# EAGLE design main (EAGLE 6.3)
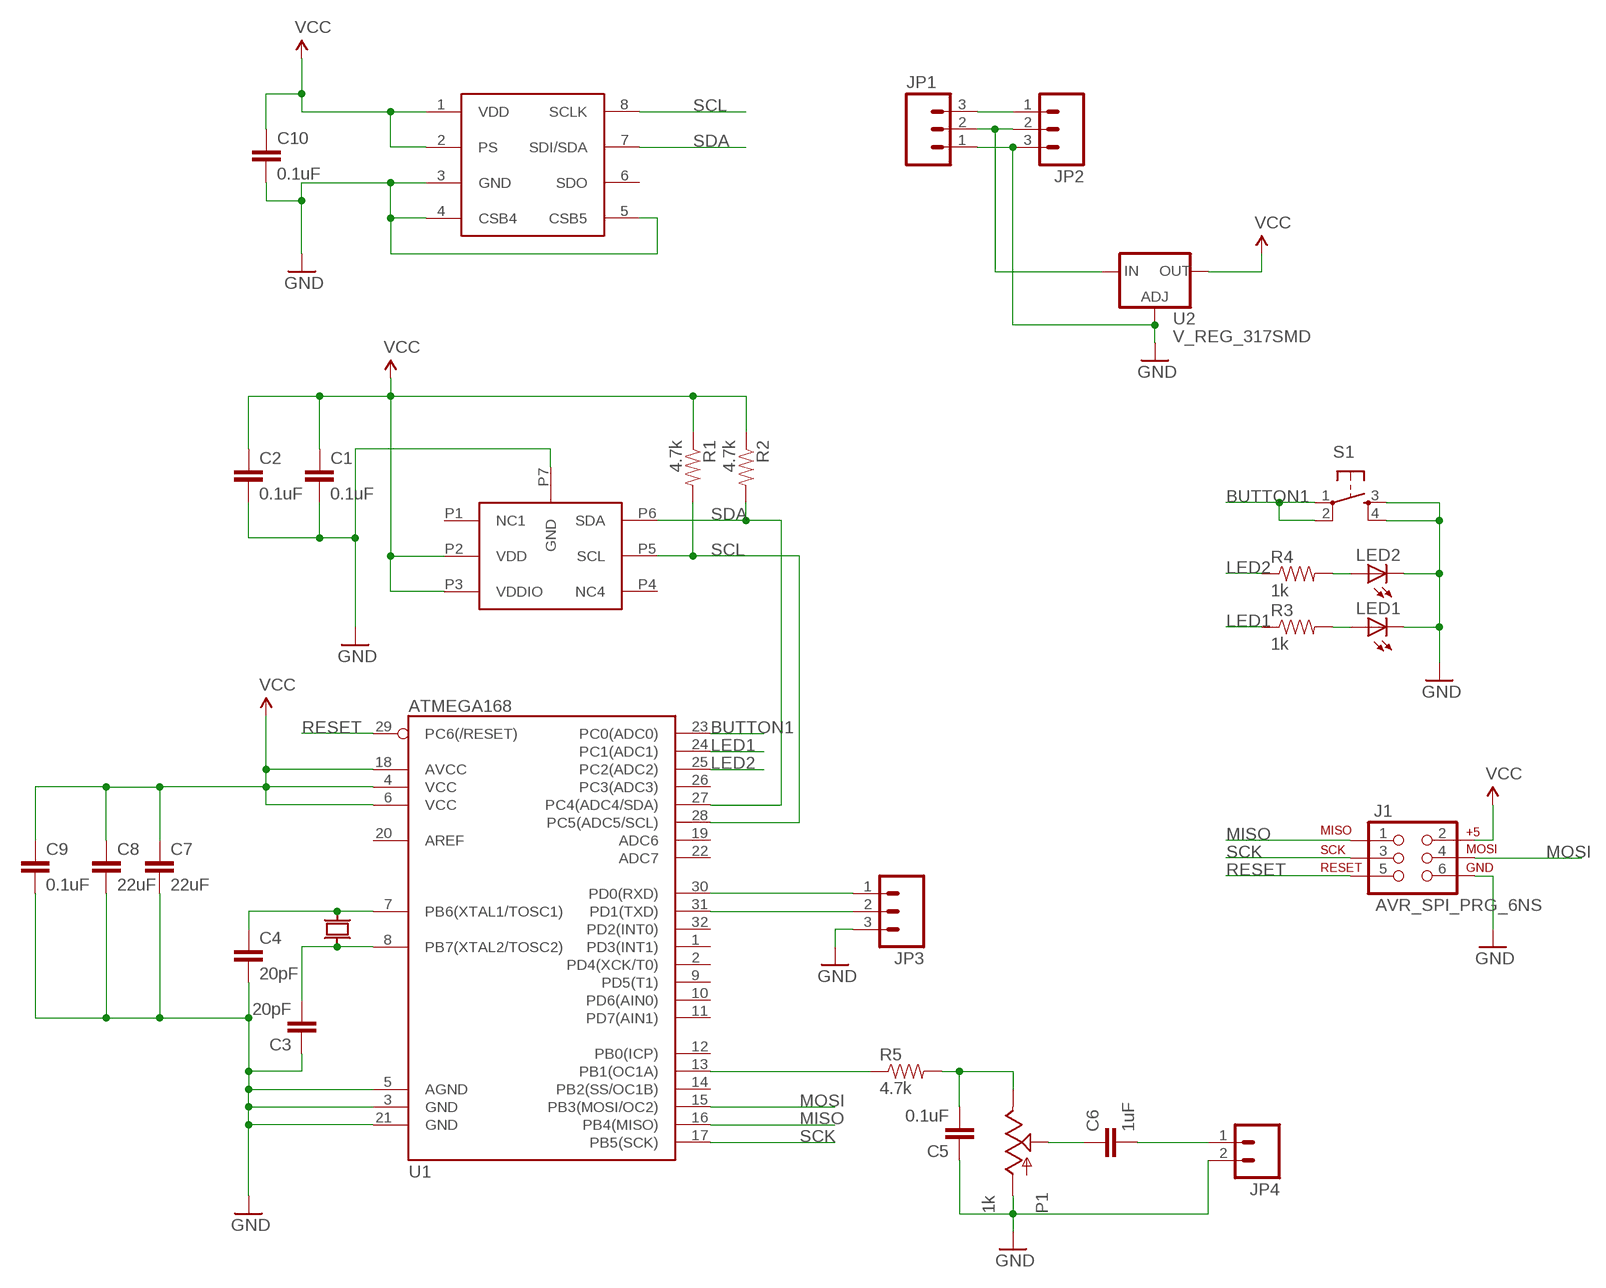
[diagram p0: schematic, sheet 1]

## Parts
C1  0.1uF  CAP0603-CAP  [0603-CAP]
C2  0.1uF  CAP0603-CAP  [0603-CAP]
C3  20pF  CAP0603-CAP  [0603-CAP]
C4  20pF  CAP0603-CAP  [0603-CAP]
C5  0.1uF  CAP0603-CAP  [0603-CAP]
C6  1uF  CAP0603-CAP  [0603-CAP]
C7  22uF  CAP0805  [0805]
C8  22uF  CAP0805  [0805]
C9  0.1uF  CAP0603-CAP  [0603-CAP]
C10  0.1uF  CAP0603-CAP  [0603-CAP]
J1  AVR_SPI_PRG_6NS  [2X3-NS]
JP1  M03PTH  [1X03]
JP2  M03PTH  [1X03]
JP3  M03PTH  [1X03]
JP4  M02PTH  [1X02]
LED1  LED0603  [LED-0603]
LED2  LED0603  [LED-0603]
P1  1k  POTTRIM  [TRIM_POT]
R1  4.7k  RESISTOR0603-RES  [0603-RES]
R2  4.7k  RESISTOR0603-RES  [0603-RES]
R3  1k  RESISTOR0603-RES  [0603-RES]
R4  1k  RESISTOR0603-RES  [0603-RES]
R5  4.7k  RESISTOR0603-RES  [0603-RES]
S1  TAC_SWITCHSMD  [TACTILE_SWITCH_SMD]
U1  ATMEGA168  [TQFP32-08]
U2  V_REG_317SMD  [SOT223]
U$1  BMP180  [BMP180]
U$2  MS5611  [MS5611]
U$3  16M  CRYSTAL  [HC49/US_7X4]

## Nets
BUTTON1: S1.1 S1.2 U1.23(PC0(ADC0))
GND: C1.2 C2.2 C3.1 C4.2 C5.1 C7.2 C8.2 C9.2 C10.2 J1.6 JP1.1 JP2.3 JP3.3 JP4.2 LED1.C LED2.C P1.3(A) S1.3 S1.4 U1.3(GND) U1.5(AGND) U1.21(GND) U2.1(ADJ) U$1.P7(GND) U$2.3(GND) U$2.4(CSB4) U$2.5(CSB5)
LED1: R3.1 U1.24(PC1(ADC1))
LED2: R4.1 U1.25(PC2(ADC2))
MISO: J1.1 U1.16(PB4(MISO))
MOSI: J1.4 U1.15(PB3(MOSI/OC2))
N$3: JP1.3 JP2.1
N$4: C4.1 U1.7(PB6(XTAL1/TOSC1)) U$3.P2
N$5: C3.2 U1.8(PB7(XTAL2/TOSC2)) U$3.P1
N$6: JP1.2 JP2.2 U2.3(IN)
N$8: JP3.1 U1.30(PD0(RXD))
N$9: LED2.A R4.2
N$10: LED1.A R3.2
N$11: JP3.2 U1.31(PD1(TXD))
N$12: R5.1 U1.13(PB1(OC1A))
N$13: C5.2 P1.2(E) R5.2
N$15: C6.1 P1.1(S)
N$16: C6.2 JP4.1
RESET: J1.5 U1.29(PC6(/RESET))
SCK: J1.3 U1.17(PB5(SCK))
SCL: R1.2 U1.28(PC5(ADC5/SCL)) U$1.P5(SCL) U$2.8(SCLK)
SDA: R2.2 U1.27(PC4(ADC4/SDA)) U$1.P6(SDA) U$2.7(SDI/SDA)
VCC: C1.1 C2.1 C7.1 C8.1 C9.1 C10.1 J1.2 R1.1 R2.1 U1.4(VCC) U1.6(VCC) U1.18(AVCC) U2.2(OUT) U$1.P2(VDD) U$1.P3(VDDIO) U$2.1(VDD) U$2.2(PS)
Unconnected: U1.1(PD3(INT1)) U1.2(PD4(XCK/T0)) U1.9(PD5(T1)) U1.10(PD6(AIN0)) U1.11(PD7(AIN1)) U1.12(PB0(ICP)) U1.14(PB2(SS/OC1B)) U1.19(ADC6) U1.20(AREF) U1.22(ADC7) U1.26(PC3(ADC3)) U1.32(PD2(INT0)) U$1.P1(NC1) U$1.P4(NC4) U$2.6(SDO)

## Library data of the parts
C1-C10 = SparkFun-Passives:CAP: Capacitor Standard 0603 ceramic capacitor, and 0.1" leaded capacitor.
J1 = SparkFun-Connectors:AVR_SPI_PRG_6: AVR ISP 6 Pin This is the reduced ISP connector for AVR programming. Common on Arduino. This footprint will take up less PCB space and can be used with a 10-pin to 6-pin adapter such as SKU: BOB-08508
JP1-JP3 = SparkFun-Connectors:M03: Header 3 Standard 3-pin 0.1" header. Use with straight break away headers (SKU : PRT-00116), right angle break away headers (PRT-00553), swiss pins (PRT-00743), machine pins (PRT-00117), and female headers (PRT-00115). Molex polarized connector foot print use with SKU : PRT-08232 with associated crimp pins and housings.
JP4 = SparkFun-Connectors:M02: Header 2 Standard 2-pin 0.1" header. Use with straight break away headers (SKU : PRT-00116), right angle break away headers (PRT-00553), swiss pins (PRT-00743), machine pins (PRT-00117), and female headers (PRT-00115). Molex polarized connector foot print use with SKU : PRT-08233 with associated crimp pins and housings.
LED1 LED2 = SparkFun-LED:LED: LEDs Standard schematic elements and footprints for 5mm, 3mm, 1206, and 0603 sized LEDs. 5mm - Spark Fun Electronics SKU : COM-00529 (and others)
P1 = SparkFun-Electromechanical:POT
R1-R5 = SparkFun-Passives:RESISTOR: Resistor Basic schematic elements and footprints for 0603, 1206, and PTH resistors.
S1 = SparkFun-Electromechanical:TAC_SWITCH: Momentary Switch Button commonly used for reset or general input. Spark Fun Electronics SKU : COM-00097
U1 = SparkFun-DigitalIC:ATMEGA168: Atmel 32-pin 8-bit micro, 16k flash.
U2 = SparkFun-PowerIC:V_REG_317: Voltage Regulator Standard LM317 adjustable voltage regulator. AOI (Adjust Output Input). Google 'LM317 Calculator' for easy to use app to get the two resistor values needed. 240/720 for 5V output. 240/390 for 3.3V output. Spark Fun Electronics SKU : COM-00527
U$1 = Custom:BMP180
U$2 = Custom:MS5611
U$3 = Custom:CRYSTAL

## Board
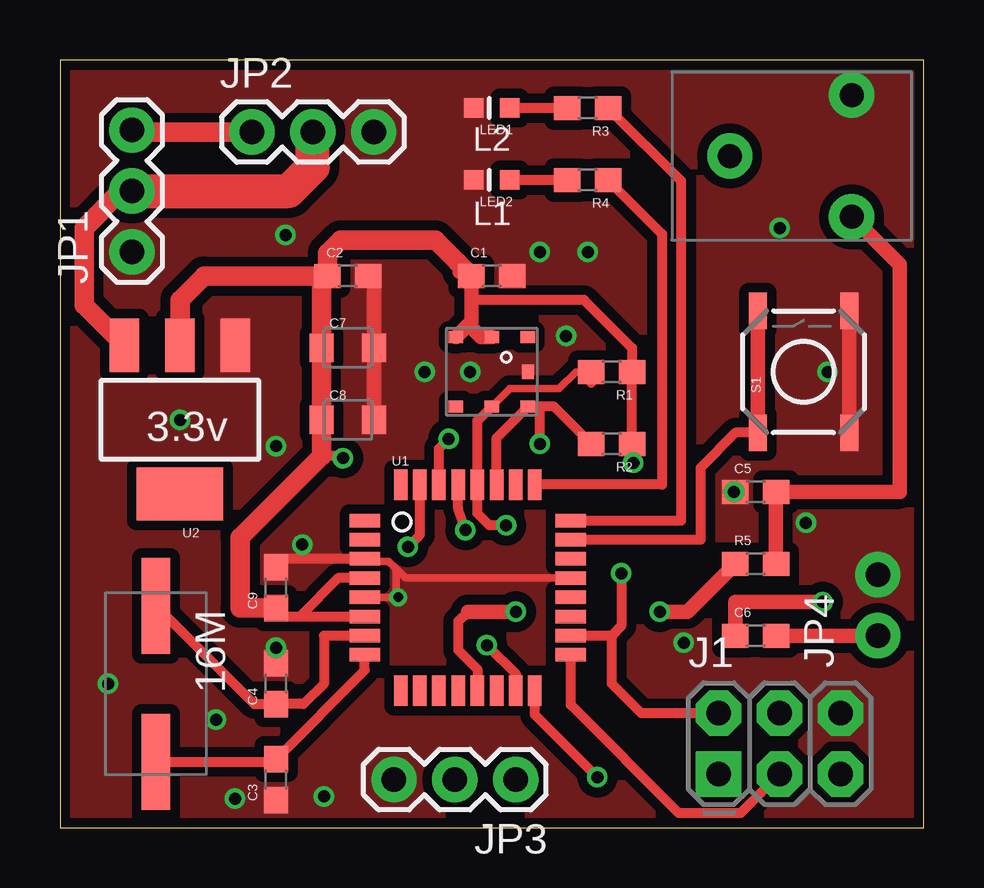
[diagram p1: board, top side]
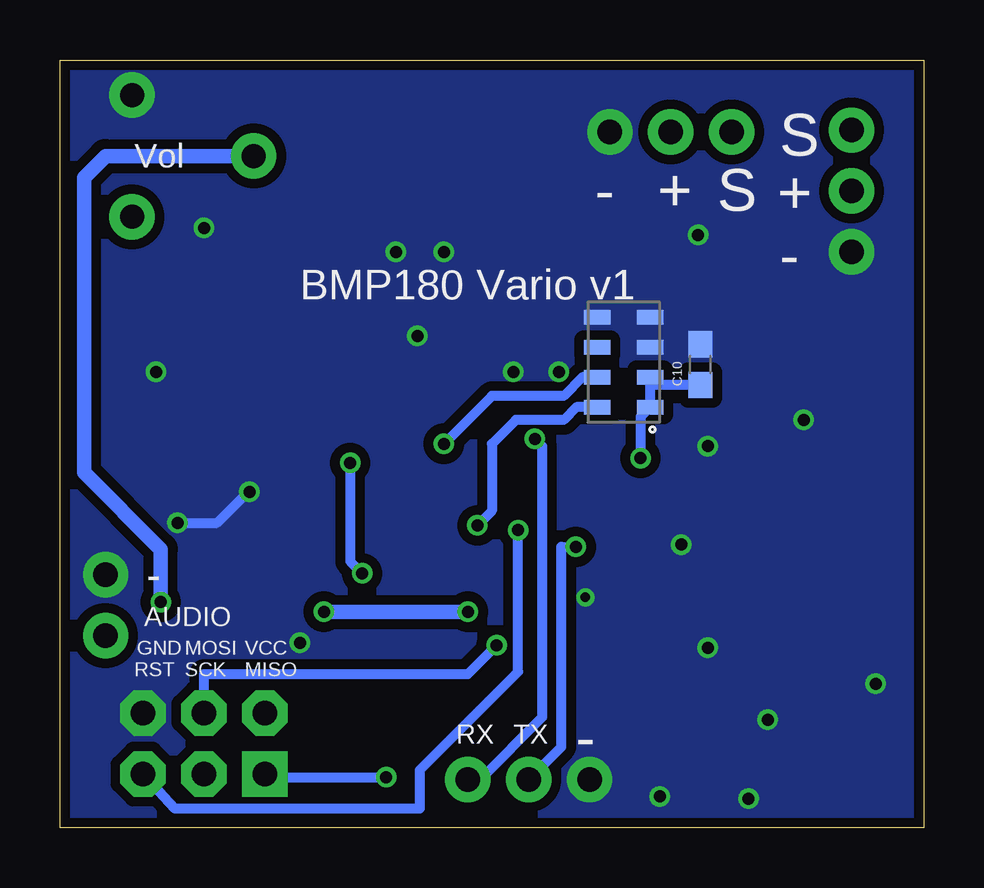
[diagram p2: board, bottom side, seen from below]

Size 36 x 32 mm. Coordinates in mm from the lower left corner, seen from the top.
Outline: 0,0 36,0 36,32 0,32 0,0
Copper layers (1*16): Top 0.0356mm / dielectric 1.5011mm / Bottom 0.0356mm
Design rules "default": minimum track width 6mil, minimum drill 13mil, track to track 6mil, track to pad 6mil, pad to pad 6mil, via to via 6mil, smd to smd 6mil, copper to edge 15mil, drill to drill 6mil, minimum pad ring 7mil, minimum via ring 7mil, stop-mask expansion 4mil, vias tented up to drill 22mil, thermal gap 10mil

### Footprints (pad centres in the part's own frame; a part is rotated, then mirrored left to right if it is on the bottom)
0603-CAP = smd 1.1 x 1: 1 -0.85,0; 2 0.85,0
0805 = smd 1 x 1.2: 1 -1.1,0; 2 1.1,0
2X3-NS = drill 1.016 pad 1.88 square: 1 -2.54,-1.27 | drill 1.016 pad 1.88 octagon: 2 -2.54,1.27; 3 0,-1.27; 4 0,1.27; 5 2.54,-1.27; 6 2.54,1.27
1X03 = drill 1.016 pad 1.88: 1 0,0; 2 2.54,0; 3 5.08,0
1X02 = drill 1.016 pad 1.88: 1 0,0; 2 2.54,0
LED-0603 = smd 0.8 x 0.8: A 0,-0.75; C 0,0.75
TRIM_POT = drill 1 pad 1.88: 1 5.08,0; 2 0,2.54; 3 0,-2.54
0603-RES = smd 1.1 x 1: 1 -0.85,0; 2 0.85,0
TACTILE_SWITCH_SMD = smd 1.524 x 0.762: 1 -2.54,1.905; 2 2.54,1.905; 3 -2.54,-1.905; 4 2.54,-1.905
TQFP32-08 = smd 1.27 x 0.559: 1 -4.293,2.8; 2 -4.293,2; 3 -4.293,1.2; 4 -4.293,0.4; 5 -4.293,-0.4; 6 -4.293,-1.2; 7 -4.293,-2; 8 -4.293,-2.8; 17 4.293,-2.8; 18 4.293,-2; 19 4.293,-1.2; 20 4.293,-0.4; 21 4.293,0.4; 22 4.293,1.2; 23 4.293,2; 24 4.293,2.8 | smd 0.559 x 1.27: 9 -2.8,-4.293; 10 -2,-4.293; 11 -1.2,-4.293; 12 -0.4,-4.293; 13 0.4,-4.293; 14 1.2,-4.293; 15 2,-4.293; 16 2.8,-4.293; 25 2.8,4.293; 26 2,4.293; 27 1.2,4.293; 28 0.4,4.293; 29 -0.4,4.293; 30 -1.2,4.293; 31 -2,4.293; 32 -2.8,4.293
SOT223 = smd 1.219 x 2.235: 1 -2.311,-3.099; 2 0,-3.099; 3 2.311,-3.099 | smd 3.6 x 2.2: 4 0,3.099
BMP180 = smd 0.6 x 0.5: P1 1.5,1.45; P2 0,1.45; P3 -1.5,1.45; P4 -1.5,-1.45; P5 0,-1.45; P6 1.5,-1.45 | smd 0.5 x 0.6: P7 1.5,0
MS5611 = smd 1.1 x 0.6: 1 -1.1,1.875; 2 -1.1,0.625; 3 -1.1,-0.625; 4 -1.1,-1.875; 5 1.1,-1.875; 6 1.1,-0.625; 7 1.1,0.625; 8 1.1,1.875
HC49/US_7X4 = smd 4 x 1.2: P1 -3.25,0; P2 3.25,0

### Placement (x,y rotation side)
C1  18,23 0 top
C2  12,23 0 top
C3  9,2 90 top
C4  9,6 90 top
C5  29,14 0 top
C6  29,8 0 top
C7  12,20 0 top
C8  12,17 0 top
C9  9,10 90 top
C10  9.3,19.3 90 bottom
J1  30,3.5 0 top
JP1  3,24 90 top
JP2  8,29 0 top
JP3  19,2 180 top
JP4  34.1,8 90 top
LED1  18,30 90 top
LED2  18,27 90 top
P1  33,28 180 top
R1  23,19 180 top
R2  23,16 180 top
R3  22,30 180 top
R4  22,27 180 top
R5  29,11 0 top
S1  31,19 90 top
U1  17,10 0 top
U2  5,17 180 top
U$1  18,19 0 top
U$2  12.5,19.4 180 bottom
U$3  4,6 90 top

### Tracks (layer width: path | path; a pad name or v marks a point on that pad's centre or on a via)
BUTTON1
  Top 0.406: S1.1 28.16,16.46 26.7,15 26.7,12 U1.23
  Top 0.61: S1.2 S1.1
GND  (via drill 0.4, 0.5)
  Top 0.305: U1.5 14,9.6 14,10.8 | 14,10.8 13.7,11.1 12.81,11.1 U1.3 | U1.21 14.4,10.4 14,10.8
  Top 0.406: U1.3 9,11.2 C9.2
  Top 0.61: C2.2 13.1,22.75 C7.2 C8.2 | S1.3 S1.4
  Bottom 0.406: v31.1,12.7 29.45,12.7 C5.1
  other vias: 28.1,14 21.1,20.5 20,24 22,24 17.1,19 15.2,19 10.1,11.8 6.5,4.5 7.3,1.2 11,1.3 9,7.5 14.1,9.6 2,6 26,7.7 5,17 9.4,24.7 32,19 30,25 9,15.9
  pour Bottom (isolate 0.406, no thermals): 0,32 0,0 36,0 36,32
  pour Top (isolate 0.406, no thermals): 0,32 0,0 36,0 36,32
LED1
  Top 0.406: U1.24 25.9,12.8 25.9,26.95 R3.1
LED2
  Top 0.406: R4.1 25.1,24.75 25.1,14.29 U1.25
MISO  (via drill 0.5)
  Top 0.406: v22.4,2.1 19.8,4.7 U1.16
  Bottom 0.406: J1.1 27.33,2.1 v22.4,2.1
MOSI  (via drill 0.5)
  Top 0.406: v17.8,7.6 19,6.4 U1.15
  Bottom 0.406: J1.4 30,6.4 19,6.4 v17.8,7.6
N$3
  Top 0.813: JP1.3 3.08,29 JP2.1
N$4
  Top 0.406: U$3.P2 8.1,5.15 C4.1 10.15,5.15 11,6 11,8 U1.7
N$5
  Top 0.406: U$3.P1 8.9,2.75 C3.2 12.71,6.56 U1.8
N$6
  Top 0.813: U2.3 1,21.79 1,25 2.54,26.54 JP1.2
  Top 1.422: JP1.2 9.54,26.54 10.54,27.54 JP2.2
N$8  (via drill 0.5)
  Top 0.406: U1.30 15.8,15.8 v16.2,16.2
  Bottom 0.406: v16.2,16.2 15.9,15.9 15.9,4.6 18.5,2 JP3.1
N$9
  Top 0.406: R4.2 LED2.A
N$10
  Top 0.406: R3.2 LED1.A
N$11  (via drill 0.5)
  Top 0.406: v14.5,11.7 15,12.2 U1.31
  Bottom 0.406: JP3.2 15.1,3.36 15.1,11.7 v14.5,11.7
N$12  (via drill 0.5)
  Top 0.406: 17,9 16.6,8.6 16.6,7.4 17.4,6.6 U1.13
  Top 0.61: R5.1 26.15,9 v25,9 | v19,9 17,9
  Bottom 0.61: v25,9 v19,9
N$13
  Top 0.61: P1.2 35,23.46 35,14 C5.2 R5.2
N$15  (via drill 0.5)
  Top 0.61: C6.1 28.15,9.4 v31.8,9.4
  Bottom 0.61: v31.8,9.4 31.8,11.6 35,14.8 35,27.1 34.1,28 P1.1
N$16
  Top 0.61: C6.2 JP4.1
RESET  (via drill 0.5)
  Top 0.406: v16.9,12.4 16.6,13.3 U1.29
  Bottom 0.406: J1.5 31.21,0.8 21,0.8 21,2.4 16.9,6.5 v16.9,12.4
SCK
  Top 0.406: J1.3 28.37,0.6 25.8,0.6 21.29,5.11 U1.17
SCL  (via drill 0.5)
  Top 0.305: U$1.P5 18.75,18.3 20.8,18.3 21.5,19 R1.2
  Top 0.406: U$1.P5 17.4,16.95 U1.28 17.4,13.1 17.9,12.6 v18.6,12.6 | 22.15,18.55 R1.2
  Bottom 0.406: U$2.8 14.47,17.52 15,17 17,17 18,16 18,13.2 v18.6,12.6
SDA  (via drill 0.5)
  Top 0.406: R2.2 20.6,17.55 20,17.55 | 20,17.55 U$1.P6 18.2,16.25 U1.27 | v20,16 20,17.55
  Bottom 0.406: U$2.7 14.22,18.77 15,18 18,18 v20,16
VCC  (via drill 0.5)
  Top 0.406: C9.1 9.35,8.8 10,8.8 | 10,8.8 U1.6 | U1.4 11.6,10.4 10,8.8 | J1.2 24.23,4.77 23,6 23,8 | 23,8 U1.18 | 17.15,22 21.85,22 23.85,20 R1.1 R2.1 23.85,15.25 v23.9,15.2 | v23.4,10.6 23.4,8.4 23,8 | 16.57,23.1 16.57,23.57 | v11.8,15.4 11.7,15.5 10.9,15.5
  Top 0.61: U$1.P3 17.02,20.98 | 17.02,20.98 17.15,21.1 17.15,22 C1.1 | U$1.P2 17.55,20.45 17.02,20.98
  Top 0.813: U2.2 5,22 6,23 C2.1 | C2.1 10.9,22.75 C7.1 C8.1 10.9,15.5 7.5,12.1 7.5,9.15 C9.1 | C1.1 16.57,23.57 15.65,24.5 11.7,24.5 11.15,23.95 C2.1
  Bottom 0.406: v23.9,15.2 23.9,11.1 v23.4,10.6 | v11.8,15.4 11.8,17.12 U$2.1 U$2.2 11.4,18.45 C10.1

### Text on the board
tPlace: L2 | L1 | 3.3v | 16M
bPlace: S | Vol | + | S | + | - | - | BMP180 Vario v1 | - | AUDIO | VCC | MOSI | GND | MISO | SCK | RST | TX | RX | -